# EAGLE design LFO (EAGLE 7.2.0)
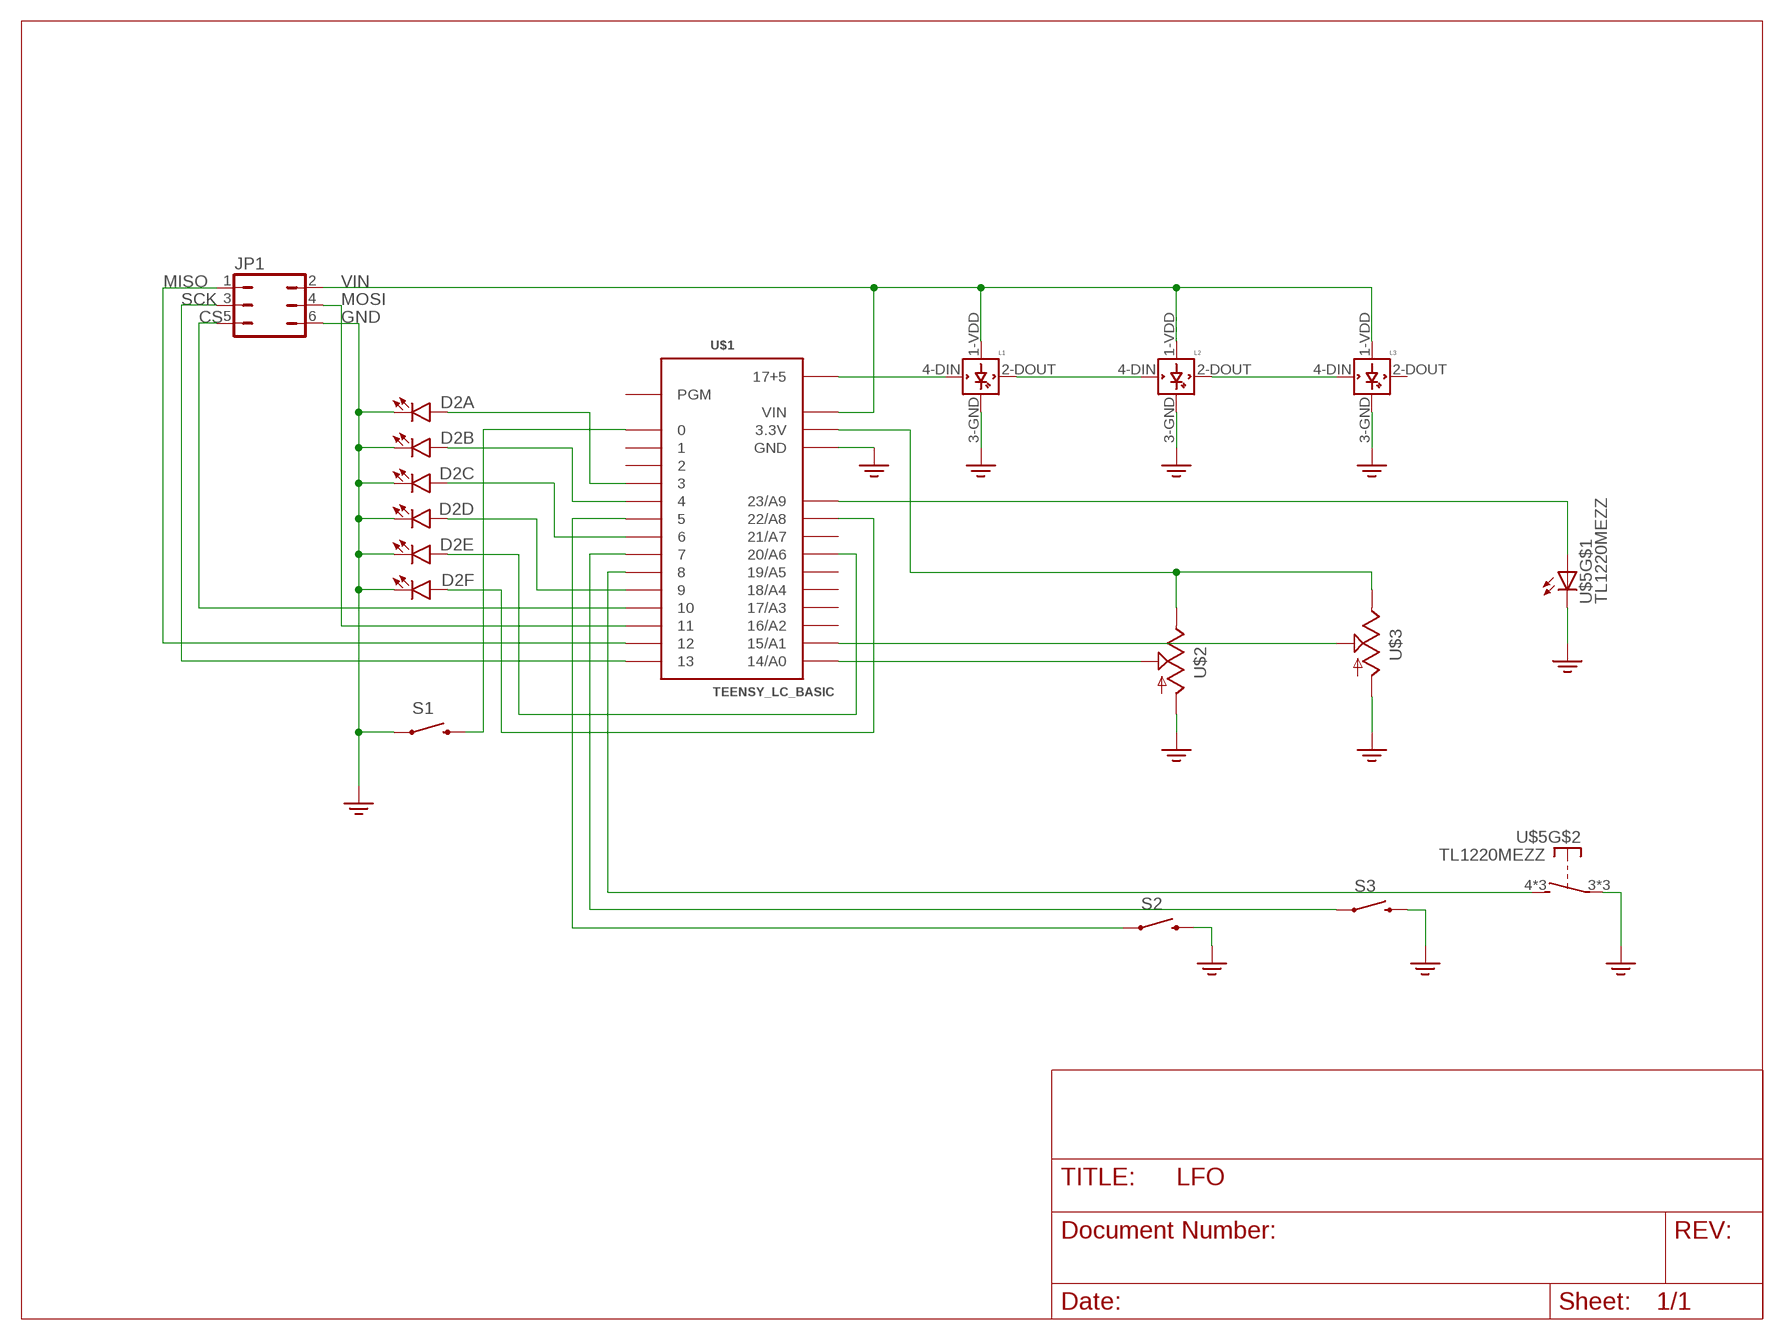
[diagram p0: schematic, sheet 1]

## Parts
D2  Blue  LED_BARGRAPH_6  [LED_BARGRAPH_6]
JP1  JP1  JP3Q  [JP3Q]
L1  WS2812B  [WS2812B]
L2  WS2812B  [WS2812B]
L3  WS2812B  [WS2812B]
S1  SWITCH-MOMENTARY-212MM  [TACTILE-PTH-12MM]
S2  SWITCH-MOMENTARY-2SMD  [TACTILE-SWITCH-SMD]
S3  SWITCH-MOMENTARY-2SMD  [TACTILE-SWITCH-SMD]
U$1  TEENSY_LC_BASIC  [TEENSY_LC_BASIC]
U$2  10K  ALPHA1400F10K  [14MMPOT]
U$3  10K  ALPHA1400F10K  [14MMPOT]
U$5  TL1220MEZZ  [MEZZ]

## Nets
3.3V: U$1.3.3V U$1.3.3V1(3.3V) U$2.P$4(E) U$3.P$4(E)
CS: JP1.5 U$1.10
GND: D2.7(F:C) D2.8(E:C) D2.9(D:C) D2.10(C:C) D2.11(B:C) D2.12(A:C) JP1.6 L1.3-GND(GND) L2.3-GND(GND) L3.3-GND(GND) S1.1 S2.3 S3.3 U$1.GND U$1.GND1(GND) U$1.GND2(GND) U$2.P$5(A) U$3.P$5(A) U$5.2(C) U$5.3(P) U$5.P$1(P) U$5.P$2(P) U$5.P$6(C) ; supply symbol labelled GND2
MISO: JP1.1 U$1.12
MOSI: JP1.4 U$1.11
N$1: L1.4-DIN(DIN) U$1.17+5
N$2: L1.2-DOUT(DOUT) L2.4-DIN(DIN)
N$3: L2.2-DOUT(DOUT) L3.4-DIN(DIN)
N$4: D2.4(D:A) U$1.9
N$5: D2.5(E:A) U$1.20/A6
N$6: D2.6(F:A) U$1.22/A8
N$7: D2.3(C:A) U$1.6
N$8: D2.1(A:A) U$1.3
N$9: D2.2(B:A) U$1.4
N$10: S1.3 U$1.0
N$11: U$1.14/A0 U$2.P$3(S)
N$12: U$1.15/A1 U$3.P$3(S)
N$13: U$1.8 U$5.4(S) U$5.P$3(S) U$5.P$4(S)
N$15: S3.1 U$1.7
N$16: U$1.23/A9 U$5.1(A) U$5.P$5(A)
N$18: S2.1 U$1.5
SCK: JP1.3 U$1.13
VIN: JP1.2 L1.1-VDD(VDD) L2.1-VDD(VDD) L3.1-VDD(VDD) U$1.VIN
Unconnected: L3.2-DOUT(DOUT) U$1.1 U$1.2 U$1.16/A2 U$1.17/A3 U$1.18/A4 U$1.19/A5 U$1.21/A7 U$1.PGM

## Library data of the parts
D2 = SynthLib:LED_BARGRAPH_6: 10-Segment LED Bar Graph SFE part numbers: COM-09935 (red, Vf = 2.1V, Ifmax = 20mA) COM-09936 (yellow, Vf = 2.1V, Ifmax = 20mA) COM-09937 (blue, Vf = 3.4V, Ifmax = 20mA) COM-09938 (green, Vf = 3.4V, Ifmax = 20mA)
JP1 = jumper:JP3Q: JUMPER
L1-L3 = SynthLib:WS2812B
S1 = SynthLib:SWITCH-MOMENTARY-2: Various NO switches- pushbuttons, reed, etc; PROD_ID: SWCH-09185
S2 S3 = SynthLib:SWITCH-MOMENTARY-2: Various NO switches- pushbuttons, reed, etc; PROD_ID: SWCH-08247
U$1 = SynthLib:TEENSY_LC_BASIC: Basic Teensy LC with none of the 'inner' pins enabled. See '+4', 'AllAnalogPins", and 'AllPins' packages for additional pin holes, as needed.
U$2 U$3 = SynthLib:ALPHA1400F: Alpha 1400F series clear shaft potentiometer
U$5 = SynthLib:TL1220MEZZ

## Board
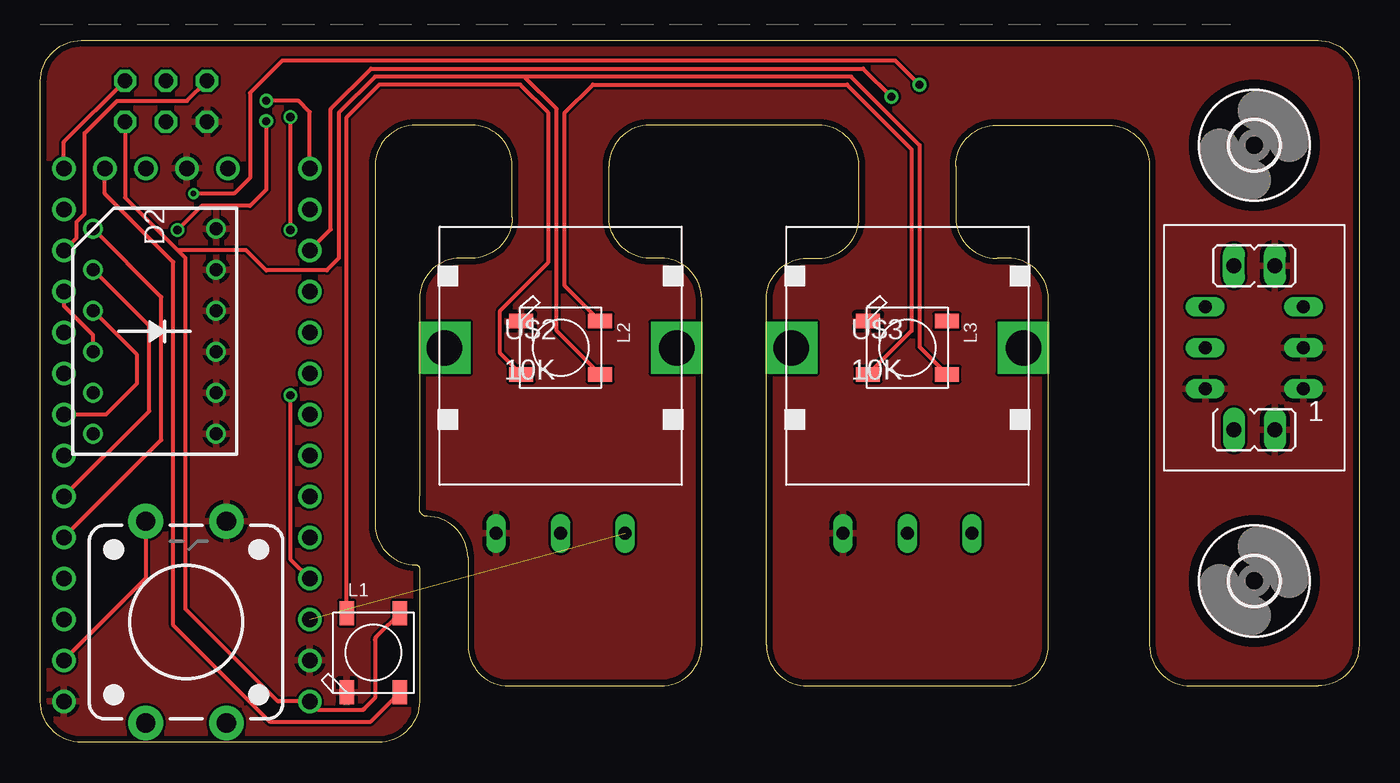
[diagram p1: board, top side]
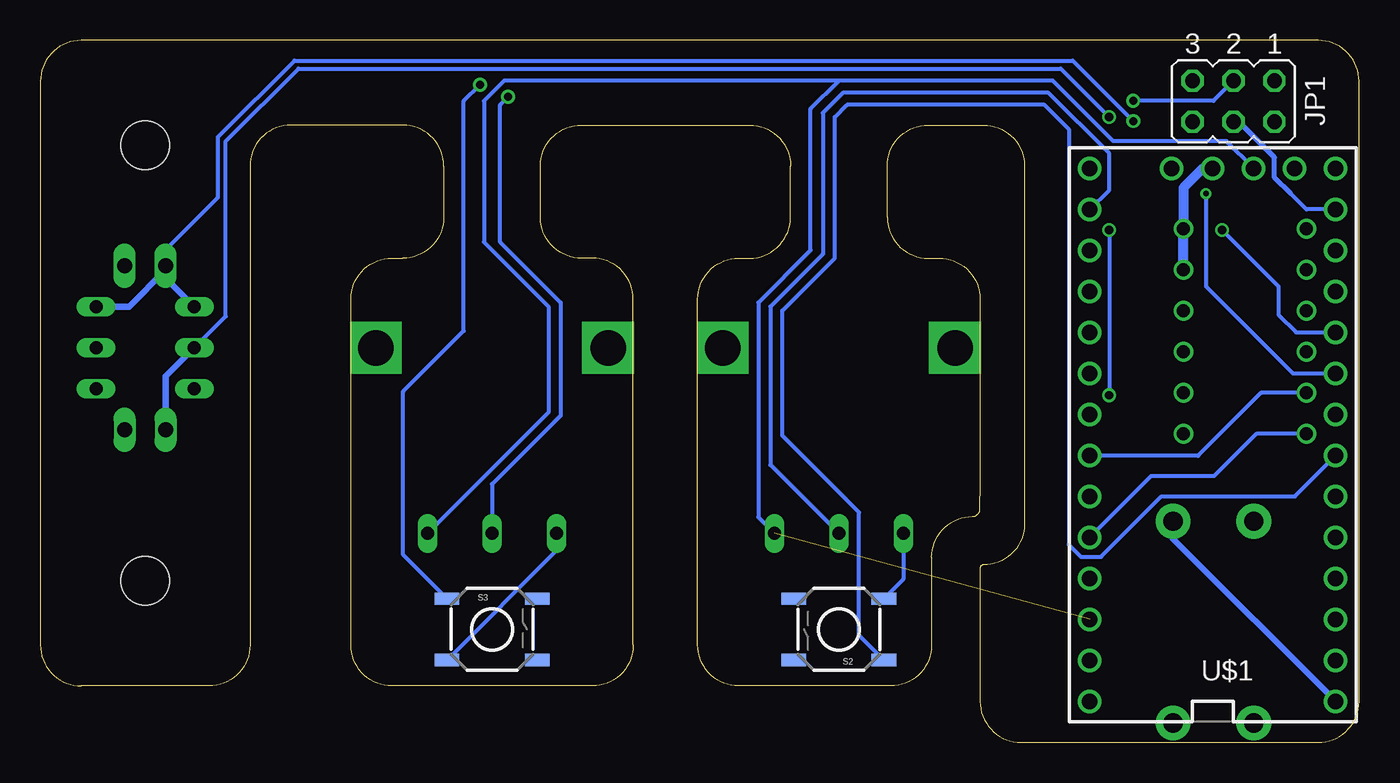
[diagram p2: board, bottom side, seen from below]

Size 81.75 x 43.5 mm. Coordinates in mm from the lower left corner, seen from the top.
Outline: 23.5,9.73 23.5,2.54 arc-90 20.96,0 2.54,0 arc-90 0,2.54 0,40.96 arc-90 2.54,43.5 79.21,43.5 arc-90 81.75,40.96 81.75,6.04 arc-90 79.21,3.5 71.29,3.5 arc-90 68.75,6.04 68.75,35.71 arc90 66.21,38.25 59.29,38.25 arc90 56.75,35.71 56.75,32.54 arc90 59.29,30 59.96,30 arc-90 62.5,27.46 62.5,6.04 arc-90 59.96,3.5 47.54,3.5 arc-90 45,6.04 45,27.46 arc-90 47.54,30 48.21,30 arc90 50.75,32.54 50.75,35.71 arc90 48.21,38.25 37.79,38.25 arc90 35.25,35.71 35.25,32.54 arc90 37.79,30 38.46,30 arc-90 41,27.46 41,6.04 arc-90 38.46,3.5 29.04,3.5 arc-90 26.5,6.04 26.5,11.46 arc90 23.96,14 arc-90 23.5,14.46 23.5,15.25
Outline: 20.75,16.52 20.75,35.71 arc-90 23.29,38.25 26.71,38.25 arc-90 29.25,35.71 29.25,32.54 arc-90 26.71,30 26.04,30 arc90 23.5,27.46 23.5,15.27
Outline: 20.75,16.5 20.75,13.54 arc90 23.29,11 arc-90 23.5,10.79 23.5,9.75
Copper layers (1*16): Top 0.0356mm / dielectric 1.5011mm / Bottom 0.0356mm
Design rules "LaenPCBOrder *": minimum track width 6mil, minimum drill 13mil, track to track 6mil, track to pad 6mil, pad to pad 6mil, via to via 6mil, smd to smd 6mil, copper to edge 15mil, drill to drill 6mil, minimum pad ring 7mil, minimum via ring 7mil, stop-mask expansion 3mil, vias tented up to drill 0mil, thermal gap 10mil

### Footprints (pad centres in the part's own frame; a part is rotated, then mirrored left to right if it is on the bottom)
LED_BARGRAPH_6 = drill 0.813: 1 -6.35,-3.81; 2 -3.81,-3.81; 3 -1.27,-3.81; 4 1.27,-3.81; 5 3.81,-3.81; 6 6.35,-3.81; 7 6.35,3.81; 8 3.81,3.81; 9 1.27,3.81; 10 -1.27,3.81; 11 -3.81,3.81; 12 -6.35,3.81
JP3Q = drill 0.914 octagon: 1 -2.54,-1.27; 2 -2.54,1.27; 3 0,-1.27; 4 0,1.27; 5 2.54,-1.27; 6 2.54,1.27
WS2812B = smd 1.5 x 0.9: 1-VDD 2.45,-1.65; 2-DOUT 2.45,1.65; 3-GND -2.45,1.65; 4-DIN -2.45,-1.65
TACTILE-PTH-12MM = drill 1.2 pad 2.159: 1 6.25,-2.5; 2 -6.25,-2.5; 3 6.25,2.5; 4 -6.25,2.5
TACTILE-SWITCH-SMD = smd 1.524 x 0.762: 1 -2.794,1.905; 2 2.794,1.905; 3 -2.794,-1.905; 4 2.794,-1.905
TEENSY_LC_BASIC = drill 0.965: 0 -7.62,13.97; 1 -7.62,11.43; 2 -7.62,8.89; 3 -7.62,6.35; 3.3V 7.62,11.43; 3.3V1 -2.54,-16.51; 4 -7.62,3.81; 5 -7.62,1.27; 6 -7.62,-1.27; 7 -7.62,-3.81; 8 -7.62,-6.35; 9 -7.62,-8.89; 10 -7.62,-11.43; 11 -7.62,-13.97; 12 -7.62,-16.51; 13 7.62,-16.51; 14/A0 7.62,-13.97; 15/A1 7.62,-11.43; 16/A2 7.62,-8.89; 17+5 -5.08,-16.51; 17/A3 7.62,-6.35; 18/A4 7.62,-3.81; 19/A5 7.62,-1.27; 20/A6 7.62,1.27; 21/A7 7.62,3.81; 22/A8 7.62,6.35; 23/A9 7.62,8.89; GND -7.62,16.51; GND1 0,-16.51; GND2 7.62,13.97; PGM 2.54,-16.51; VIN 7.62,16.51
14MMPOT = drill 2.2 square: P$1 -7.2,0; P$2 7.2,0 | drill 0.8 long: P$3 0,-11.5; P$4 4,-11.5; P$5 -4,-11.5
3,0 = hole 3: 0,0
MEZZ = drill 0.914 long: 1 -5.08,1.27; 2 -5.08,-1.27; 3 5.08,-1.27; 4 5.08,1.27 | drill 0.8 long: P$1 -2.54,-3.048; P$2 -2.54,3.048; P$3 2.54,-3.048; P$4 2.54,3.048; P$5 0,3.048; P$6 0,-3.048

### Placement (x,y rotation side)
D2  7.08,25.47 270 top
JP1  7.79,39.73 180 bottom
L1  20.65,5.56 90 top
L2  32.25,24.45 0 top
L3  53.75,24.45 0 top
S1  9.04,7.45 90 top
S2  32.25,7 180 bottom
S3  53.75,7 0 bottom
U$1  9.08,19.05 180 bottom
U$2  32.25,24.45 0 top
U$3  53.75,24.45 0 top
U$4  [3,0]  75.25,10 0 top
U$5  75.25,24.45 90 top
U$6  [3,0]  75.25,37 0 top

### Tracks (layer width: path | path; a pad name or v marks a point on that pad's centre or on a via)
3.3V  (1 unrouted)
  Bottom 0.254: U$1.3.3V1 8.23,37.25 15.25,37.25 19,41 32.25,41 | 32.25,41 53,41 54.25,39.75 54.25,31 50.25,27 50.25,20.45 U$3.P$4 | 32.25,41 34,39.25 34,30.5 37.25,27.25 37.25,13.95 U$2.P$4
CS
  Top 0.254: U$1.10 2.25,31.27 2.25,32.25 2.75,32.75 2.75,37.75 4.75,39.75 9.08,39.75 JP1.5
GND
  Top 0.254: L1.3-GND 19,3.15 arc45 18.93,3.32 18.75,3.5 | D2.10
  Bottom 0.254: U$3.P$5 49.75,11.89 S3.3 | U$2.P$5 28.25,10.11 S2.3
  Bottom 0.406: S1.1 11.54,12.62 U$1.GND
  Bottom 0.61: D2.11 10.92,29.25 11,29.25 10.89,29.36 D2.12 10.89,34.36 9.69,35.56 U$1.GND1
  pour Top: -0.5,44.25 83,44.25 83,-0.5 -0.5,-0.5
MISO
  Top 0.254: U$1.12 1.46,37.21 JP1.1
MOSI
  Bottom 0.254: U$1.11 3.27,33.02 4.25,34
  Bottom 0.305: 4.25,34 5.25,35 5.25,36.25 7.46,38.46 JP1.4
N$1
  Top 0.254: L1.4-DIN 20.44,1.25 14.25,1.25 8.25,7.25 8.25,29.75 4,34 U$1.17+5
N$2
  Top 0.254: L2.4-DIN 28.5,24.1 28.5,26.75 31.5,29.75 31.5,39 29.75,40.75 21,40.75 19,38.75 L1.2-DOUT
N$3
  Top 0.254: L2.2-DOUT 32.5,28.3 32.5,39 34.25,40.75 50,40.75 54,36.75 54,25.5 L3.4-DIN
N$4
  Top 0.254: U$1.9 1.46,27.04 3.25,25.25 3.25,24.22 D2.4
N$5
  Bottom 0.254: D2.5 6.09,21.66 10,17.75 16.67,17.75 U$1.20/A6
N$6
  Bottom 0.254: D2.6 6.38,19.12 9,16.5 12.9,16.5 U$1.22/A8
N$7
  Top 0.254: U$1.6 4.07,20.32 6,22.25 6,24.01 D2.3
N$8
  Top 0.254: U$1.3 7.5,18.75 7.5,27.59 D2.1
N$9
  Top 0.254: D2.2 6.75,25.8 6.75,20.53 U$1.4
N$10
  Top 0.254: S1.3 6.54,10.15 U$1.0
N$11
  Bottom 0.254: U$2.P$3 36.5,17.2 36.5,27 33.25,30.25 33.25,39 32,40.25 19.25,40.25 15.5,36.5 15.5,34.22 U$1.14/A0
N$12  (via drill 0.5)
  Top 0.254: U$1.15/A1 18,31.78 18,39.25 20.5,41.75 51,41.75 v52.75,40
  Bottom 0.254: U$3.P$3 53.75,16 49.5,20.25 49.5,27.25 53.25,31 53.25,39.5 v52.75,40
N$13  (via drill 0.5)
  Top 0.254: v14,38.5 14,34.25 13,33.25 10,33.25 v8.5,31.75
  Bottom 0.254: v14,38.5 17.75,42.25 66,42.25 70.75,37.5 70.75,33.75 74,30.5 74,29.55 U$5.4 | v8.5,31.75 5,28.25 5,26.5 3.9,25.4 U$1.8
  Bottom 0.406: U$5.P$4 73.98,28.77 U$5.4 73.98,29.27 76.25,27 U$5.P$3
N$15  (via drill 0.33, 0.5)
  Top 0.254: v54.5,40.75 53,42.25 15,42.25 13,40.25 13,35 12,34 v9.5,34
  Bottom 0.254: S3.1 59.25,11.61 59.25,21.75 55.5,25.5 55.5,39.75 v54.5,40.75 | v9.5,34 9.5,28.25 4.11,22.86 U$1.7
N$16  (via drill 0.5)
  Top 0.254: v15.5,38.75 v15.5,31.75 | v15.5,21.5 15.5,11.36 U$1.23/A9
  Bottom 0.254: v15.5,31.75 v15.5,21.5 | U$5.P$5 70.25,26.4 70.25,37.25 65.75,41.75 18.5,41.75 v15.5,38.75
  Bottom 0.406: U$5.1 73.98,22.67 U$5.P$5
N$18
  Bottom 0.254: S2.1 31,6.64 31,14.25 35.75,19 35.75,26.75 32.5,30 32.5,38.75 31.75,39.5 19.5,39.5 18,38 18,12.25 17.25,11.5 16,11.5 12.25,15.25 3.99,15.25 U$1.5
SCK  (via drill 0.5)
  Top 0.254: U$1.13 16.7,39.05 16,39.75 v14.01,39.75
  Bottom 0.254: JP1.3 9.04,39.75 v14.01,39.75
VIN
  Top 0.254: L1.1-VDD 20.82,6.53 arc45 20.75,6.35 20.75,2.75 20.07,2.07 arc-45 19.89,2 17.24,2 U$1.VIN 14.81,2.54 arc-45 14.64,2.61 9,8.25 9,30 8.5,30.5 | L2.1-VDD 32,25.5 32,39.25 30,41.25 | 30,41.25 20.75,41.25 18.5,39 18.5,30 17.75,29.25 14,29.25 12.75,30.5 8.5,30.5 | 30,41.25 50.25,41.25 54.5,37 54.5,24.5 L3.1-VDD | 8.5,30.5 5.25,33.75 JP1.2